# Altium schematic sheet Expansion & Miscelaneous.SchDoc
size A
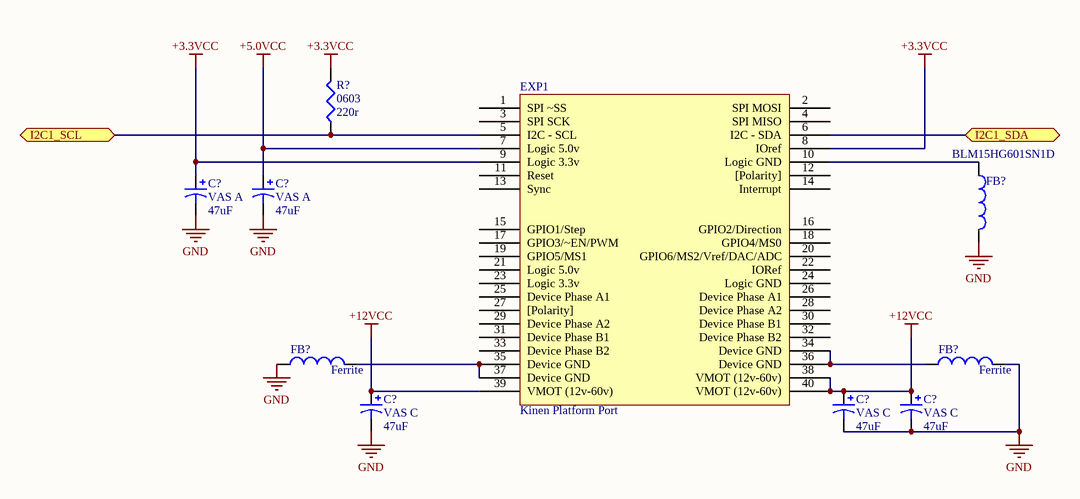
[diagram p0: Expansion & Miscelaneous.SchDoc]

## Parts
(Parts that share a designator on the sheet are numbered #1, #2 ... from top to bottom, then left to right.)
C?#1  VAS A  value 47uF  [Panasonic VS A]
C?#2  VAS A  value 47uF  [Panasonic VS A]
C?#3  VAS C  value 47uF  [Panasonic VS C]
C?#4  VAS C  value 47uF  [Panasonic VS C]
C?#5  VAS C  value 47uF  [Panasonic VS C]
EXP1  Kinen Platform Port  [Kinen Port]
FB?#1  BLM15HG601SN1D  [BLM18PG121SN1D]
FB?#2  Ferrite  [SM 0805 - gap trimmed]
FB?#3  Ferrite  [SM 0805 - gap trimmed]
R?  0603  value 220r  [J1-0603]

## Ports
I2C1_SCL, I2C1_SDA

## Nets
+3.3VCC: C?#1.1 EXP1.8(IOref) EXP1.9(Logic_3.3v) R?.2
+5.0VCC: C?#2.1 EXP1.7(Logic_5.0v)
+12VCC: C?#3.1 C?#4.1 C?#5.1 EXP1.38(VMOT_(12v-60v)) EXP1.39(VMOT_(12v-60v)) EXP1.40(VMOT_(12v-60v))
GND: C?#1.2 C?#2.2 C?#3.2 C?#4.2 C?#5.2 FB?#1.2 FB?#2.1 FB?#3.2
I2C1_SCL: EXP1.5(I2C_-_SCL) R?.1 ; port I2C1_SCL
I2C1_SDA: EXP1.6(I2C_-_SDA) ; port I2C1_SDA
NetEXP1_10: EXP1.10(Logic_GND) FB?#1.1
NetEXP1_34: EXP1.34(Device_GND) EXP1.36(Device_GND) FB?#3.1
NetEXP1_35: EXP1.35(Device_GND) EXP1.37(Device_GND) FB?#2.2

Not connected (* = marked no-connect by the designer): EXP1 1(SPI_~SS) 2(SPI_MOSI) 3(SPI_SCK) 4(SPI_MISO) 11(Reset) 12([Polarity]) 13(Sync) 14(Interrupt) 15(GPIO1/Step) 16(GPIO2/Direction) 17(GPIO3/~EN/PWM) 18(GPIO4/MS0) 19(GPIO5/MS1) 20(GPIO6/MS2/Vref/DAC/ADC) 21(Logic_5.0v) 22(IORef) 23(Logic_3.3v) 24(Logic_GND) 25(Device_Phase_A1) 26(Device_Phase_A1) 27([Polarity]) 28(Device_Phase_A2) 29(Device_Phase_A2) 30(Device_Phase_B1) 31(Device_Phase_B1) 32(Device_Phase_B2) 33(Device_Phase_B2)

## Library data of the parts
C?#1-C?#5 = Cap Pol3: Polarized Capacitor (Surface Mount); Published: 8-Jun-2000; LatestRevisionDate: 29-May-2009; LatestRevisionNote: IPC-7351 Footprint Added.; PackageReference: C0805; Publisher: Altium Limited; PackageDescription: Chip Capacitor
EXP1 = Kinen Port
FB?#1-FB?#3 = Inductor: Code_IEC: 1005; Published: 8-Jun-2000; LatestRevisionDate: 17-Jul-2002; LatestRevisionNote: Re-released for DXP Platform.; PackageReference: 0402-A; Publisher: Altium Limited; Code_JEITA: 0402
R? = Res3: Resistor; Published: 8-Jun-2000; LatestRevisionDate: 29-May-2009; LatestRevisionNote: IPC-7351 Footprint Added.; PackageReference: J1-0603; Publisher: Altium Limited; PackageDescription: Chip Resistor